# Altium schematic sheet FanControllerSch.SchDoc
size A
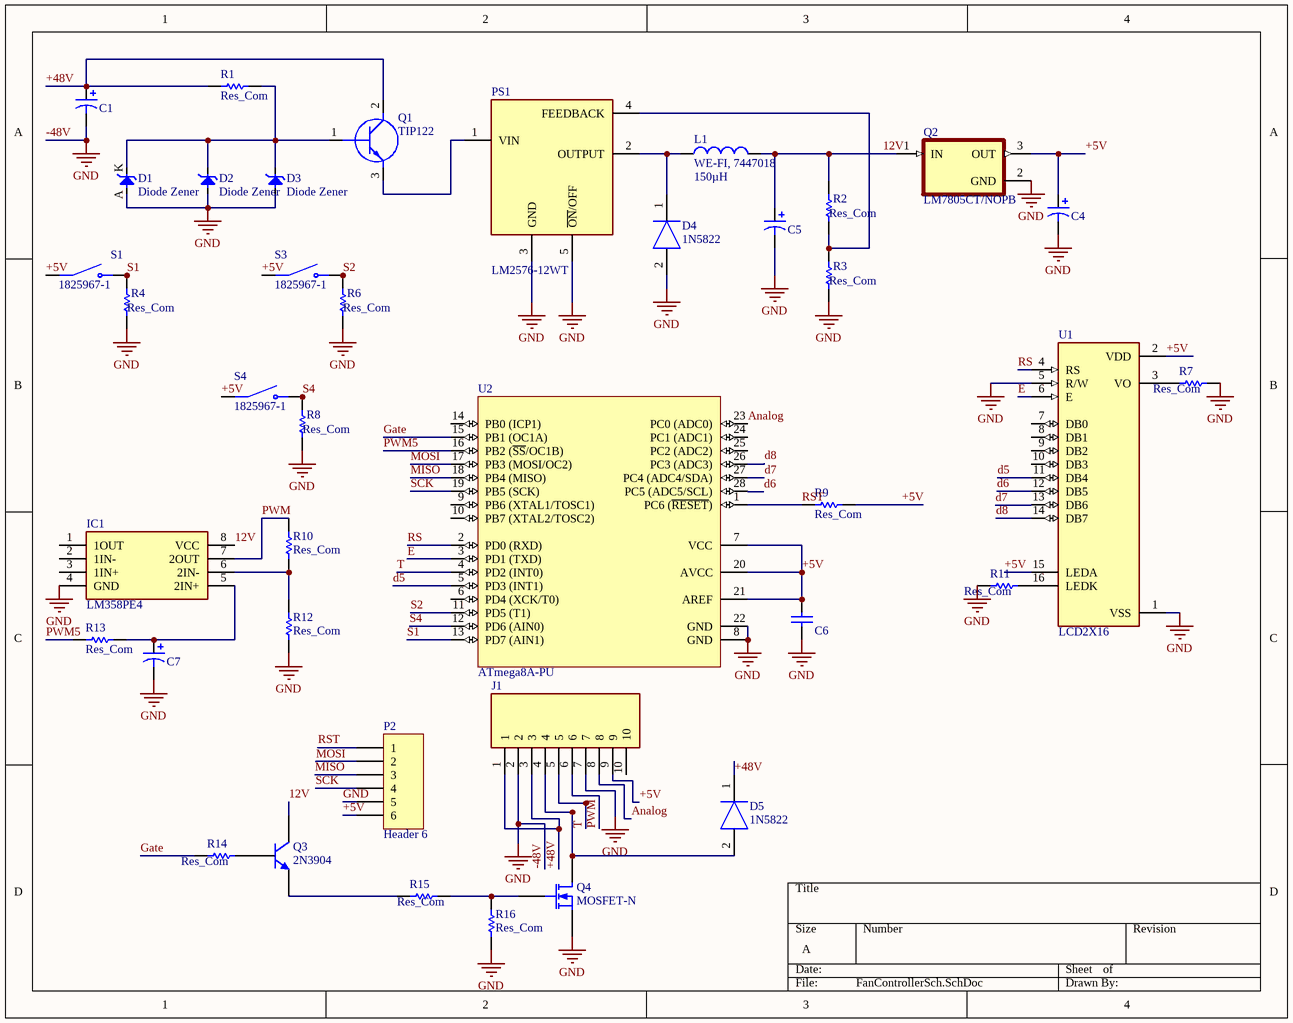
[diagram p0: FanControllerSch.SchDoc]

## Parts
C1  100 μF  [Radial 12.5 x 25]  (value not drawn)
C4  100 μF  [RADIAL 3.5x7.7]  (value not drawn)
C5  100 μF  [RADIAL 3.5x7.7]  (value not drawn)
C6  100 nF  [Ceramic Capacitor 2]  (value not drawn)
C7  100 μF  [RADIAL 3.5x7.7]  (value not drawn)
D1  Diode Zener  [ONSC-AXIAL_LEAD-2-59-10_P]
D2  Diode Zener  [ONSC-AXIAL_LEAD-2-59-10_P]
D3  Diode Zener  [ONSC-AXIAL_LEAD-2-59-10_P]
D4  1N5822  [ONSC-AXIAL_LEAD-2-59-10_P]
D5  1N5822  [ONSC-AXIAL_LEAD-2-59-10_P]
IC1  LM358PE4  [DIP794W53P254L959H508Q8N]
J1  1-282837-0  [TE_1-282837-0]  (value not drawn)
L1  WE-FI, 7447018  value 150µH  [TSL0709RA-102KR19-PF]
P2  Header 6  [HDR1X6]
PS1  LM2576-12WT  [TO170P470X1016X1900-5P]
Q1  TIP122  [TO255P460X1020X2008-3P]
Q2  LM7805CT/NOPB  [TO254P1054X470X2600-3]
Q3  2N3904  [TO-92A]
Q4  MOSFET-N  [TO-220AB]
R1  Res_Com  [1K Ohm]
R2  Res_Com  [1K Ohm]
R3  Res_Com  [1K Ohm]
R4  Res_Com  [1K Ohm]
R6  Res_Com  [1K Ohm]
R7  Res_Com  [1K Ohm]
R8  Res_Com  [1K Ohm]
R9  Res_Com  [1K Ohm]
R10  Res_Com  [1K Ohm]
R11  Res_Com  [1K Ohm]
R12  Res_Com  [1K Ohm]
R13  Res_Com  [1K Ohm]
R14  Res_Com  [1K Ohm]
R15  Res_Com  [1K Ohm]
R16  Res_Com  [1K Ohm]
S1  1825967-1  [SW_1825967-1]
S3  1825967-1  [SW_1825967-1]
S4  1825967-1  [SW_1825967-1]
U1  LCD2X16  [LCD_LCD2X16]
U2  ATmega8A-PU  [28P3]

## Nets
-48V: C1.2 C4.2 C5.2 C6.1 C7.2 D1.A D2.A D3.A D4.2(A) IC1.4(GND) J1.2 J1.7 P2.5 PS1.3(GND) PS1.5(~{ON}/OFF) Q2.2(GND) Q4.3(S) R3.1 R4.1 R6.1 R7.1 R8.1 R11.2 R12.2 R16.2 U1.1(VSS) U1.5(R/W) U2.8(GND) U2.22(GND)  [also labelled GND]
12V: C5.1 IC1.8(VCC) L1.2 Q2.1(IN) Q3.3(C) R2.2
+5V: C4.1 C6.2 J1.9 P2.6 Q2.3(OUT) R9.2 S1.1(COM) S1.2(COM) S3.1(COM) S3.2(COM) S4.1(COM) S4.2(COM) U1.2(VDD) U1.15(LEDA) U2.7(VCC) U2.20(AVCC) U2.21(AREF)
+48V: C1.1 D5.1(K) J1.1 J1.3 Q1.2(C) R1.2
Analog: J1.8 U2.23(PC0_(ADC0))
d5: U1.11(DB4) U2.5(PD3_(INT1))
d6: U1.12(DB5) U2.28(PC5_(ADC5/SCL))
d7: U1.13(DB6) U2.27(PC4_(ADC4/SDA))
d8: U1.14(DB7) U2.26(PC3_(ADC3))
E: U1.6(E) U2.3(PD1_(TXD))
Gate: R14.2 U2.15(PB1_(OC1A))
MISO: P2.3 U2.18(PB4_(MISO))
MOSI: P2.2 U2.17(PB3_(MOSI/OC2))
PWM: IC1.7(2OUT) J1.6 R10.1
PWM5: R13.2 U2.16(PB2_(~{SS}/OC1B))
RS: U1.4(RS) U2.2(PD0_(RXD))
RST: P2.1 R9.1 U2.1(PC6_(~{RESET}))
S1: R4.2 S1.3(NO) S1.4(NO) U2.13(PD7_(AIN1))
S2: R6.2 S3.3(NO) S3.4(NO) U2.11(PD5_(T1))
S4: R8.2 S4.3(NO) S4.4(NO) U2.12(PD6_(AIN0))
SCK: P2.4 U2.19(PB5_(SCK))
T: J1.5 U2.4(PD2_(INT0))
NetC7_1: C7.1 IC1.5(2IN+) R13.1
NetD1_K: D1.K D2.K D3.K Q1.1(B) R1.1
NetD4_1: D4.1(K) L1.1 PS1.2(OUTPUT)
NetD5_2: D5.2(A) J1.4 Q4.1(D)
NetIC1_6: IC1.6(2IN-) R10.2 R12.1
NetPS1_1: PS1.1(VIN) Q1.3(E)
NetPS1_4: PS1.4(FEEDBACK) R2.1 R3.2
NetQ3_1: Q3.1(E) R15.2
NetQ3_2: Q3.2(B) R14.1
NetQ4_2: Q4.2(G) R15.1 R16.1
NetR7_2: R7.2 U1.3(VO)
NetR11_1: R11.1 U1.16(LEDK)

Not connected (* = marked no-connect by the designer): IC1 1(1OUT) 2(1IN-) 3(1IN+); J1 10; U1 7(DB0) 8(DB1) 9(DB2) 10(DB3); U2 6(PD4_(XCK/T0)) 9(PB6_(XTAL1/TOSC1)) 10(PB7_(XTAL2/TOSC2)) 14(PB0_(ICP1)) 24(PC1_(ADC1)) 25(PC2_(ADC2))

## Library data of the parts
C1 C4 C5 C7 = Electrolitic Capacitor, Thru-Hole: Contact: cynetik_group@hotmail.com; Published: 28 April 2014; Publisher: Cynetik Group; Created by: Zion Blue; Value: 100 μF
C6 = Ceramic Capacitor, Thru-Hole.: Ceramic Capacitor, Thru-Hole; Contact: cynetik_group@hotmail.com; Value: 100 nF; Created by: Zion Blue; Published: 28 April 2014; Publisher: Cynetik Group
D1-D3 = Diode Zener: pin to pad: A>2 K>1
D4 D5 = 1N5822: Diode; Manufacturer_Name: HY Electronic Corp; Datasheet Link: https://docs.rs-online.com/7b99/0900766b814bbef7.pdf; Manufacturer_Part_Number: 1N5822
IC1 = LM358PE4: Integrated Circuit; Manufacturer_Name: Texas Instruments; Datasheet Link: http://www.ti.com/lit/ds/symlink/lm358.pdf; Height: 5.08mm; Manufacturer_Part_Number: LM358PE4; Arrow Part Number: LM358PE4; Arrow Price/Stock: https://www.arrow.com/en/products/lm358pe4/texas-instruments; Mouser Part Number: 595-LM358PE4; Mouser Price/Stock: https://www.mouser.co.uk/ProductDetail/Texas-Instruments/LM358PE4?qs=VBduBm9rCJTWtuRHSrRjAg%3D%3D
J1 = 1-282837-0: TERMI-BLOK PCB MOUNT 10P; MF: TE Connectivity; Value: *; Price: None; Package: None; Availability: Unavailable; SnapEDA_Link: https://www.snapeda.com/parts/1-282837-0/TE%20Connectivity%20AMP%20Connectors/view-part/520357/?ref=snap; EU_RoHS_Compliance: Compliant with Exemptions; DigiKey-Purchase-URL: https://snapeda.com/shop?store=DigiKey&id=520357; MP: 1-282837-0
L1 = WE-FI, 7447018: WE-FI Leaded Toroidal Line Choke, L = 150µH; Manufacturer: Wurth Elektronik; partNo: 7447018; ComponentLink1Description: Manufacturer; ComponentLink1URL: http://www.we-online.de; Created by: Baojun Chen; Created Date: Feb.2016; ComponentLink2Description: Datasheet; ComponentLink2URL: http://katalog.we-online.de/pbs/datasheet/7447018.pdf
P2 = Header 6: Header, 6-Pin; LatestRevisionDate: 17-Jul-2002; LatestRevisionNote: Re-released for DXP Platform.; Publisher: Altium Limited
PS1 = LM2576-12WT: Power Supply; Manufacturer_Name: Microchip; Datasheet Link: http://ww1.microchip.com/downloads/en/DeviceDoc/lm2576.pdf; Height: 4.7mm; Manufacturer_Part_Number: LM2576-12WT; Arrow Part Number: LM2576-12WT; Arrow Price/Stock: https://www.arrow.com/en/products/lm2576-12wt/microchip-technology; Mouser Part Number: 998-LM2576-12WT; Mouser Price/Stock: https://www.mouser.co.uk/ProductDetail/Microchip-Technology-Micrel/LM2576-12WT?qs=kh6iOki%2FeLFUlIqd4u5Ybw%3D%3D
Q1 = TIP122: Transistor BJT NPN; Manufacturer_Name: STMicroelectronics; Datasheet Link: http://www.st.com/web/en/resource/technical/document/datasheet/CD00000911.pdf; Height: 4.6mm; Manufacturer_Part_Number: TIP122; Arrow Part Number: TIP122; Arrow Price/Stock: https://www.arrow.com/en/products/tip122/stmicroelectronics; Mouser Part Number: 511-TIP122; Mouser Price/Stock: https://www.mouser.co.uk/ProductDetail/STMicroelectronics/TIP122?qs=ljbEvF4DwOPuWPwhe20bIQ%3D%3D
Q2 = LM7805CT/NOPB: Linear Voltage Regulator IC 1 Output 1A TO-220-3; MF: ON Semiconductor; MP: LM7805CT; SnapEDA_Link: https://www.snapeda.com/parts/LM7805CT/ON%20Semiconductor/view-part/546231/?ref=snap; Price: None; Package: TO-220 ON Semiconductor; Value: *; Availability: Unavailable
Q3 = 2N3904: NPN General Purpose Amplifier; Published: 8-Jun-2000; LatestRevisionDate: 15-Jan-2003; LatestRevisionNote: PCB Footprint 'BCY-W3/D4.7' replaced; DatasheetVersion: 1997; PackageVersion: Sep-1998; PackageReference: TO-92A; Publisher: Altium Limited; PackageDescription: TO, Flat Index; 3 In-Line, Axial Leads; Body Dia. 4.5mm; Leads 0.51 x 0.48 mm (max); ComponentLink1Description: Manufacturer Link; ComponentLink1URL: http://www.fairchildsemi.com/; ComponentLink2Description: Datasheet; ComponentLink2URL: http://www.fairchildsemi.com/ds/2N%2F2N3904.pdf
Q4 = MOSFET-N: N-Channel MOSFET; Published: 8-Jun-2000; LatestRevisionDate: 17-Jul-2002; LatestRevisionNote: Re-released for DXP Platform.; PackageVersion: 1995/1996; PackageReference: E3; Publisher: Altium Limited; PackageDescription: TO, Flat Index; 3 In-Line, Axial Leads; Body Dia. 4.6mm; Lead Dia. 0.5 mm (max)
S1 S3 S4 = 1825967-1: Switch Tactile OFF (ON) SPST Round Button PC Pins 0.05A 24VDC 1.57N Thru-Hole; MF: TE Connectivity; Package: None; Price: None; SnapEDA_Link: https://www.snapeda.com/parts/1825967-1/TE%20Connectivity%20/%20DEUTSCH/view-part/398388/?ref=snap; Value: *; Availability: Warning; MP: 1825967-1; DigiKey-Purchase-URL: https://snapeda.com/shop?store=DigiKey&id=398388; Mouser-Purchase-URL: https://snapeda.com/shop?store=Mouser&id=398388; BuyPart: https://www.snapeda.com/parts/1825967-1/TE%20Connectivity%20/%20DEUTSCH/view-part/398388/?ref=eda
U1 = LCD2X16: Display; Display: LCD 2x16 characters (blue backlight); MF: mikroElektronika; SnapEDA_Link: https://www.snapeda.com/parts/LCD2X16/mikroElektronika/view-part/2472530/?ref=snap; Price: None; Package: None; Availability: Unavailable; Value: *; MP: LCD2X16
U2 = ATmega8A-PU: 8-bit AVR Microcontroller, 2.7-5.5V, 16MHz, 8KB Flash, 512 Bytes EEPROM, 1KB SRAM, 28-pin PDIP, Industrial Grade (-40°C to 85°C); DatasheetVersion: revD, Feb-2011; PackageVersion: revB, Sep-2001; PackageReference: 28P3; PackageDescription: 28-lead (0.300"/7.62mm Wide) Plastic Dual Inline Package (PDIP); ComponentLink1Description: Manufacturer URL; ComponentLink1URL: http://www.atmel.com/; ComponentLink2Description: ATmega8A Datasheet; ComponentLink2URL: http://www.atmel.com/dyn/resources/prod_documents/doc8159.pdf; ComponentLink3Description: ATmega8A Summary; ComponentLink3URL: http://www.atmel.com/dyn/resources/prod_documents/8159S.pdf